# Altium schematic sheet USB_A & USB_C.SchDoc
size A3; DocumentNumber: 12; SheetNumber: 13; SheetTotal: 14
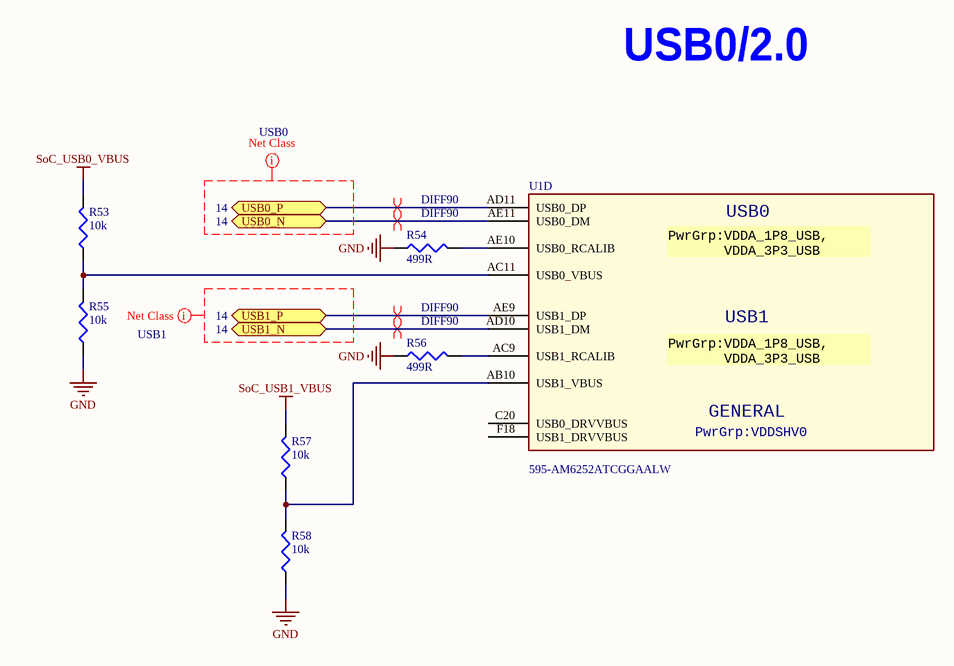
[diagram p0: USB_A & USB_C.SchDoc]

## Parts
R53  10k  [R0402]
R54  499R  [R0402]
R55  10k  [R0402]
R56  499R  [R0402]
R57  10k  [R0402]
R58  10k  [R0402]
U1  Supplier Part Number 1: 595-AM6252ATCGGAALW  [BGA425C50P25X25_1300X1300X89]  (hidden comment: AM62-EVM_BGA425)  (part D of 18)

## Ports
USB0_N (bidir, see 14), USB0_P (bidir, see 14), USB1_N (bidir, see 14), USB1_P (bidir, see 14)

## Nets
GND: R54.1 R55.1 R56.1 R58.1
SoC_USB0_VBUS: R53.2
SoC_USB1_VBUS: R57.2
USB0_N: U1.AE11(USB0_DM) ; port USB0_N
USB0_P: U1.AD11(USB0_DP) ; port USB0_P
USB1_N: U1.AD10(USB1_DM) ; port USB1_N
USB1_P: U1.AE9(USB1_DP) ; port USB1_P
NetR53_1: R53.1 R55.2 U1.AC11(USB0_VBUS)
NetR54_2: R54.2 U1.AE10(USB0_RCALIB)
NetR56_2: R56.2 U1.AC9(USB1_RCALIB)
NetR57_1: R57.1 R58.2 U1.AB10(USB1_VBUS)

Not connected (* = marked no-connect by the designer): U1 C20(USB0_DRVVBUS) F18(USB1_DRVVBUS)

## Layout directives
differential pair; net class DIFF90: USB0_N, USB0_P, USB1_N, USB1_P
net class USB0: (no net found under the mark)
net class USB1: (no net found under the mark)

## Notes on the sheet
- USB0/2.0
- (in symbol AM62-EVM_BGA425, part D) USB0; PwrGrp:VDDA_1P8_USB, / VDDA_3P3_USB; USB1; GENERAL; PwrGrp:VDDSHV0

## Library data of the parts
R53 R55 R57 R58 = RC0402FR-0710KL: RES 10.0K OHM 1/16W 1% 0402 SMD; Manufacturer: Yageo; Power (Watts): 0.063W, 1/16W; .Checked PCB: used; Temperature Coefficient: ±100ppm/°C; Category: Resistors; Supplier Part Number: 311-10.0KLRCT-ND; Manufacturer Part Number: RC0402FR-0710KL; Package / Case: 0402 (1005 Metric); Price 1k [$]: 0.01421; Resistance (Ohms): 10K; Tolerance: ±1%; Value: 10k; .Checked SCH: used; Supplier: Digikey; Supplier 1: Digi-Key; Supplier Part Number 1: 311-10.0KLRCT-ND; RoHS: RoHS Compliant; Stock 1: 2916495; Pricing 1: 10=0.014, 50=0.0104, 100=0.0079, 250=0.00584, 500=0.00432, 1000=0.00288 (USD); Composition: Thick Film; Features: -; Size / Dimension: 0.039" L x 0.020" W (1.00mm x 0.50mm); Height: 0.016" (0.40mm); Number of Terminations: 2; Packaging: Cut Tape (CT); ComponentLink1URL: http://www.yageo.com/documents/recent/PYu-RC0402_51_RoHS_L_6.pdf; ComponentLink1Description: http://www.yageo.com/documents/recent/PYu-RC0402_51_RoHS_L_6.pdf
R54 R56 = RT0402BRD07499RL: RES SMD 499 OHM 0.1% 1/16W 0402; Manufacturer: Yageo; Power Rating: 62.5mW; Voltage Rating: 50V; Max Power Dissipation: 63mW; Temperature Coefficient: 25ppm/°C; Supplier 1: Digi-Key; Manufacturer Part Number: RT0402BRD07499RL; Stock 1: 20000; Pricing 1: 10000=0.0411, 30000=0.0391, 50000=0.0383, 100000=0.0375 (USD); Case/Package: 0402; Case Code (Metric): 1005; Case Code (Imperial): 0402; Size Code: 0402; Min Operating Temperature: -55°C; Max Operating Temperature: 155°C; Package Quantity: 10000; Packaging: Tape and Reel; Resistance: 499R; Tolerance: 0.1%; Resistor Type: Thin Film; Number of Terminations: 2; Termination: SMD/SMT; Voltage Rating (DC): 50V; Features: Moisture Resistant; Series: RT; Length: 0.039inch; Width: 0.02inch; Height: 0.014inch; Lead Free: Lead Free; RoHS Compliant: Yes; ComponentLink1URL: https://datasheet.ciiva.com/12724/pyu-rt-1-to-0-05-rohs-l-4-12724797.pdf?src-supplier=Mouser; ComponentLink1Description: https://datasheet.ciiva.com/12724/pyu-rt-1-to-0-05-rohs-l-4-12724797.pdf?src-supplier=Mouser; ComponentLink2URL: https://datasheet.ciiva.com/2582/pyu-rt-1-to-0-05-rohs-l-4-2582397.pdf?src-supplier=Digi-Key; ComponentLink2Description: https://datasheet.ciiva.com/2582/pyu-rt-1-to-0-05-rohs-l-4-2582397.pdf?src-supplier=Digi-Key; ComponentLink3URL: https://datasheet.ciiva.com/46635/pyu-rt-1-to-0-05-rohs-l-5-46635222.pdf?src-supplier=Digi-Key; ComponentLink3Description: https://datasheet.ciiva.com/46635/pyu-rt-1-to-0-05-rohs-l-5-46635222.pdf?src-supplier=Digi-Key; Supplier Part Number 1: YAG1440TR-ND
U1 = AM62-EVM_BGA425: ARM® Cortex®-A53 Microprocessor IC Sitara™ 2 Core, 64-Bit 1.4GHz 425-FCCSP (13x13); Manufacturer: Texas Instruments; Manufacturer Part Number: AM6252ATCGGAALW; Supplier 1: Mouser; Stock 1: 0; Pricing 1: 1=21.23, 10=19.58, 50=18.7, 100=18.7, 1000=15.94, 10000=15.94 (USD)